# EAGLE design 12V PSU 700W (EAGLE 9.6.2)
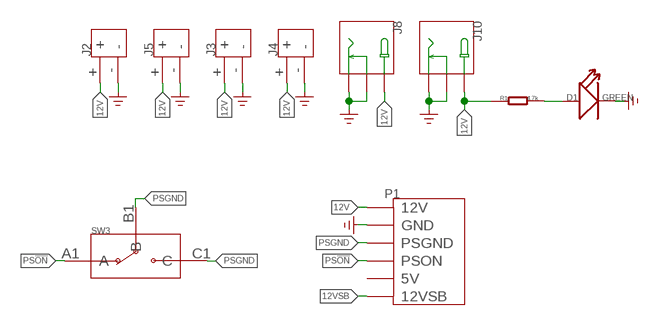
[diagram p0: schematic, sheet 1]

## Parts
D1  GREEN  LED0603  [LED-0603]
J2  XT-PWR-CONN-THXT60-F  [XT60-F-TH]
J3  XT-PWR-CONN-THXT30-F  [XT30-F-TH]
J4  XT-PWR-CONN-THXT30-F  [XT30-F-TH]
J5  XT-PWR-CONN-THXT60-F  [XT60-F-TH]
J8  POWER-JACK-DC'DC-012A'  [DCJ3P-14.2X11.0X9.0MM-V]
J10  POWER-JACK-DC'DC-012A'  [DCJ3P-14.2X11.0X9.0MM-V]
P1  PSU-750W  [PSU-750W]
R1  4.7k  R-0603  [R0603]
SW3  SWITCH-STICK-3P  [SWITCH-STICK-3P]

## Nets
12V: J2.+ J3.+ J4.+ J5.+ J8.+ J10.+ P1.P4(12V) P1.P5(12V) P1.P6(12V) R1.1
12VSB: P1.7(12VSB)
GND: D1.- J2.- J3.- J4.- J5.- J8.- J8.S(CDN) J10.- J10.S(CDN) P1.P1(GND) P1.P2(GND) P1.P3(GND) ; supply symbol labelled GND_POWER
N$4: D1.+ R1.2
PS!ON: P1.11(PSON) SW3.A1(A)
PSGND: P1.15(PSGND) SW3.B1(B) SW3.C1(C)
Unconnected: P1.5(5V) P1.9(5V) P1.13(5V)

## Library data of the parts
D1 = G2:LED
J2-J5 = DC PSU:XT-PWR-CONN-TH
J8 J10 = DC PSU:POWER-JACK-DC: 3P-L11.6*W9.6*H7.0MM:320120002;3P-L14.2*W11.0*H9.0MM:320120003
P1 = DC PSU:PSU-750W
R1 = GroveX:R*
SW3 = DC PSU:SWITCH-STICK-3P

## Net classes
0 default: width 0.127 mm, drill 0.203 mm, clearance 0.127 mm

## Board
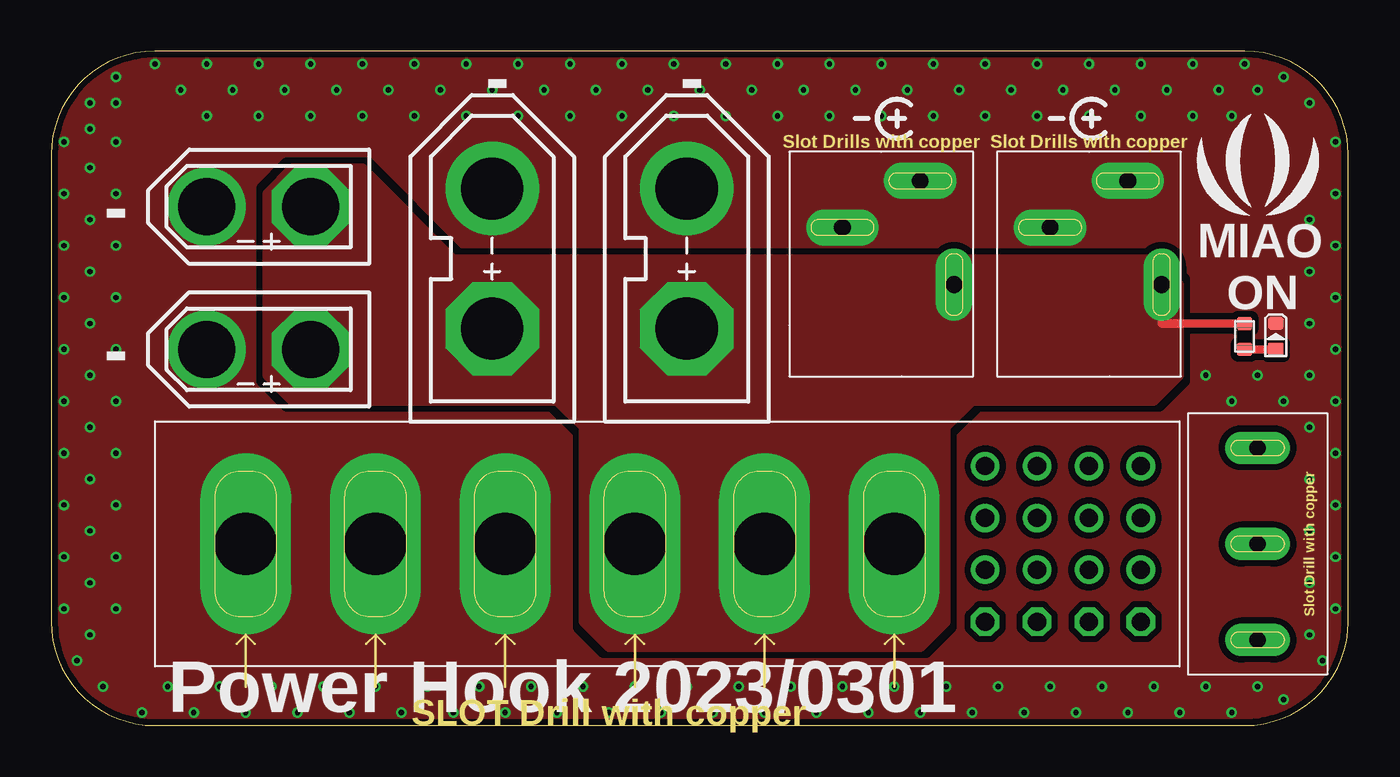
[diagram p1: board, top side]
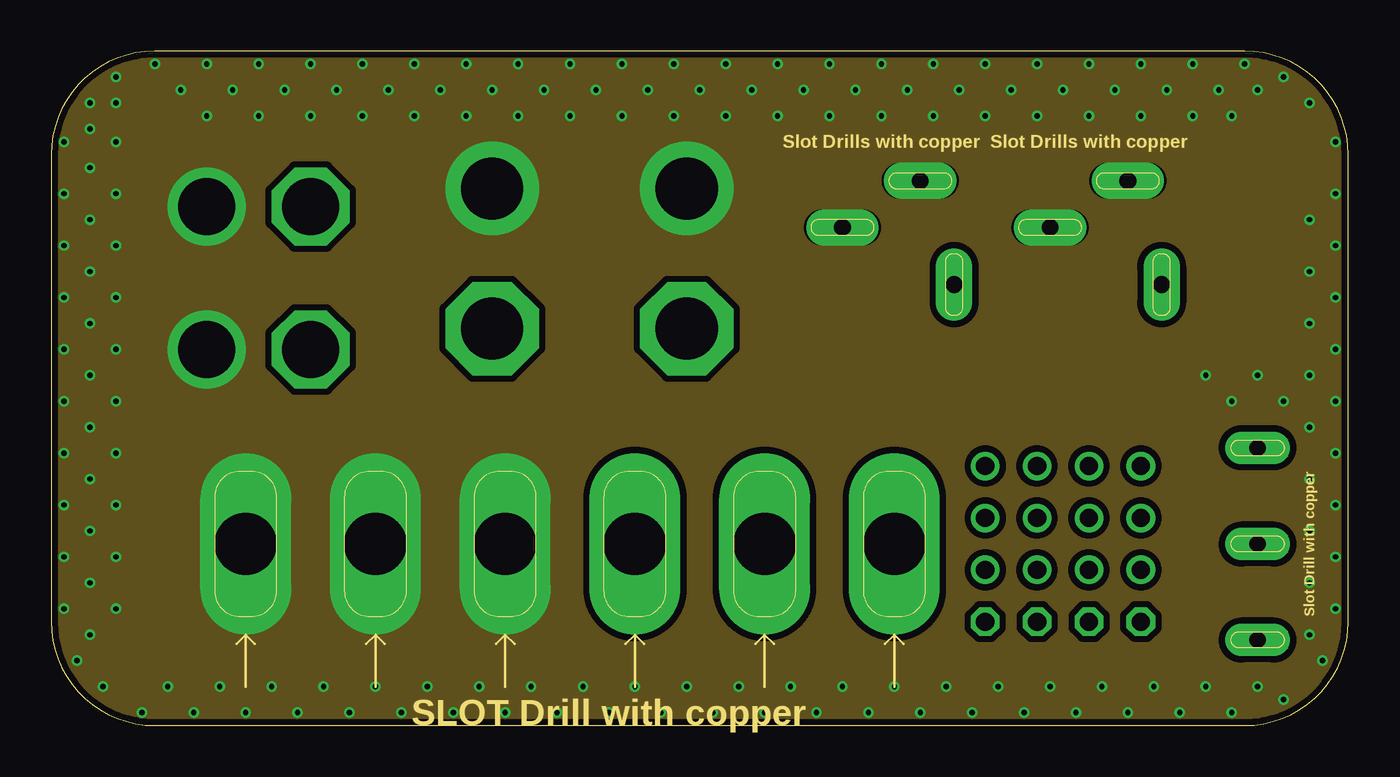
[diagram p2: board, inner layer Route2]
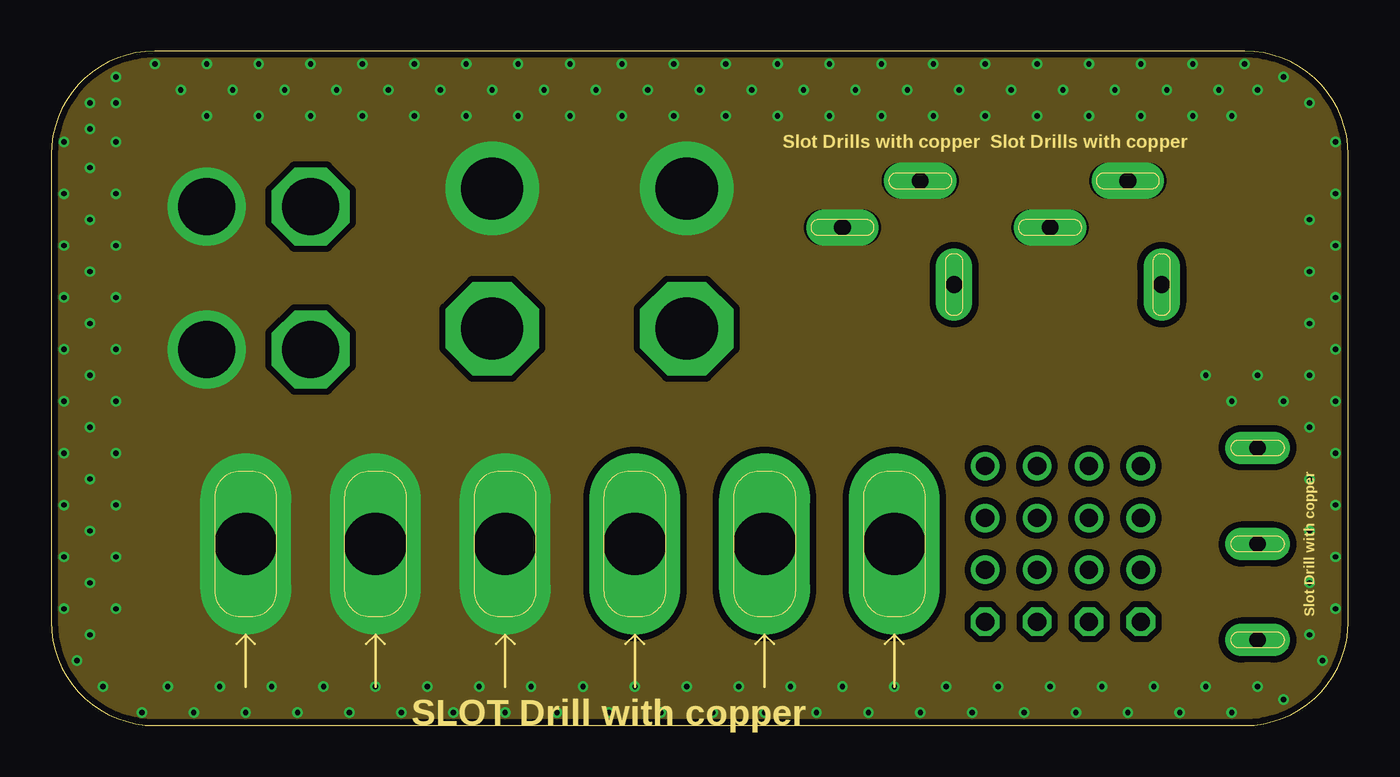
[diagram p3: board, inner layer Route15]
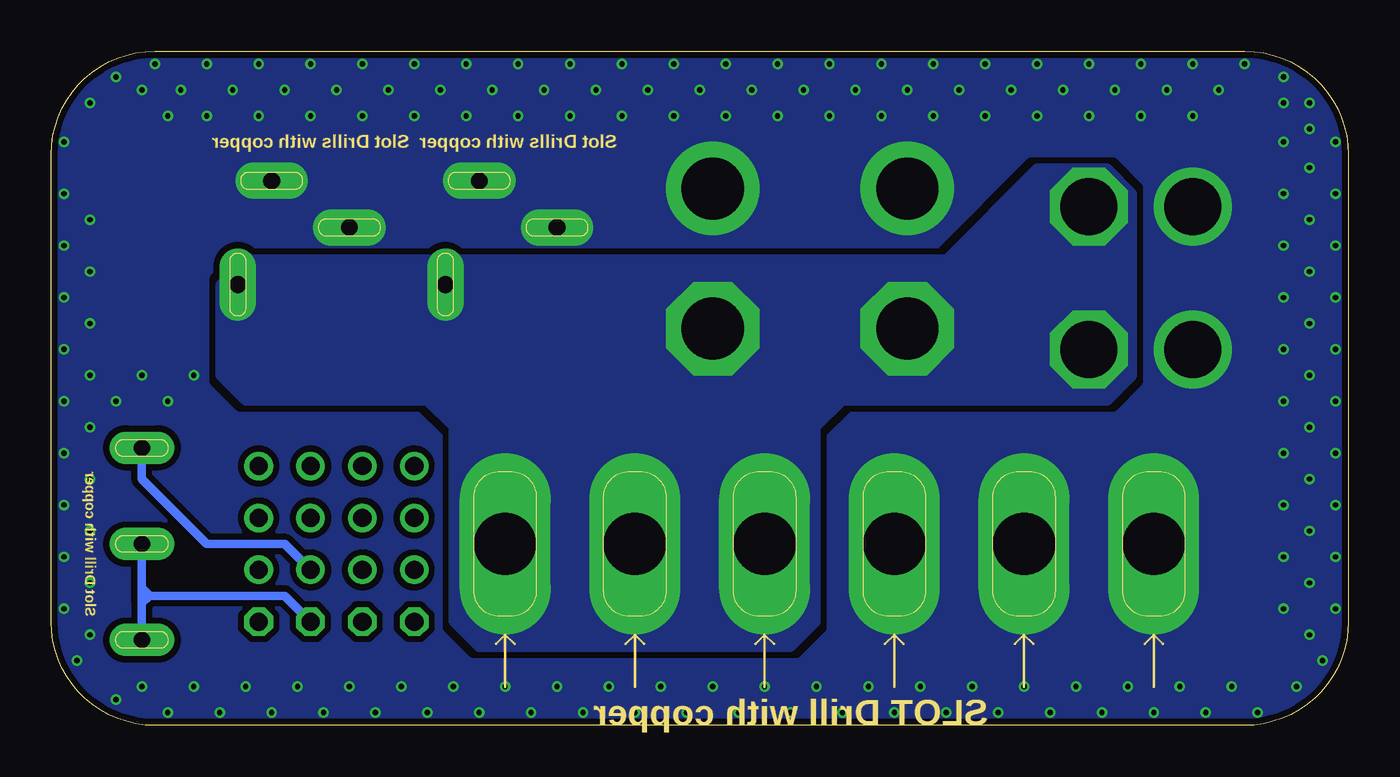
[diagram p4: board, bottom side, seen from below]

Size 63.5 x 33.02 mm. Coordinates in mm from the lower left corner, seen from the top.
Outline: 63.5,5.08 63.5,27.94 arc90 58.42,33.02 5.08,33.02 arc90 0,27.94 0,5.08 arc90 5.08,0 58.42,0 arc90 63.5,5.08
Copper layers (1+2*15+16): Top 0.035mm / dielectric 1.5mm / Route2 0.035mm / dielectric 0.15mm / Route15 0.035mm / dielectric 0.2mm / Bottom 0.035mm
Design rules "default *": minimum track width 1mil, minimum drill 8mil, track to track 6mil, track to pad 6mil, pad to pad 6mil, via to via 6mil, smd to smd 0mil, copper to edge 8mil, drill to drill 8mil, minimum pad ring 4mil, minimum via ring 4mil, stop-mask expansion 4mil, vias tented up to drill 20mil, thermal gap 10mil

### Footprints (pad centres in the part's own frame; a part is rotated, then mirrored left to right if it is on the bottom)
LED-0603 = smd 0.635 x 0.762: + -0.635,0; - 0.635,0
XT60-F-TH = drill 3.048 pad 4.572 octagon: + -3.429,0 | drill 3.048 pad 4.572: - 3.429,0
XT30-F-TH = drill 2.794 pad 3.81 octagon: + -2.54,0 | drill 2.794 pad 3.81: - 2.54,0
DCJ3P-14.2X11.0X9.0MM-V = drill 0.813 pad 1.778 long: + -3.556,0; - -1.905,-5.08; S 1.905,-2.794
PSU-750W = drill 0.889 pad 1.397: 1 10.795,3.81; 2 13.335,3.81; 3 15.875,3.81; 4 18.415,3.81; 5 10.795,1.27; 6 13.335,1.27; 7 15.875,1.27; 8 18.415,1.27; 9 10.795,-1.27; 10 13.335,-1.27; 11 15.875,-1.27; 12 18.415,-1.27 | drill 0.889 pad 1.397 octagon: 13 10.795,-3.81; 14 13.335,-3.81; 15 15.875,-3.81; 16 18.415,-3.81 | drill 3.048 pad 4.445 long: P1 -25.4,0; P2 -19.05,0; P3 -12.7,0; P4 -6.35,0; P5 0,0; P6 6.35,0
R0603 = smd 0.635 x 0.762: 1 -0.635,0; 2 0.635,0
SWITCH-STICK-3P = drill 0.8 pad 1.6 long: A1 -4.7,0; B1 0,0; C1 4.7,0

### Placement (x,y rotation side)
D1  59.94,19.05 90 top
J2  31.11,22.86 90 top
J3  10.16,18.41 180 top
J4  10.16,25.4 180 top
J5  21.59,22.86 90 top
J8  40.64,21.59 180 top
J10  50.8,21.59 180 top
P1  34.92,8.89 0 top
R1  58.42,19.05 270 top
SW3  59.05,8.89 270 top
U$11  [SEEED-SILK-280*268MIL]  59.05,26.67 0 top

### Tracks (layer width: path | path; a pad name or v marks a point on that pad's centre or on a via)
12V
  Top 0.406: R1.1 54.36,19.68 J10.+
  pour Top (isolate 0.406, no thermals): 26.04,5.08 26.04,14.61 24.77,15.88 11.81,15.88 10.54,17.14 10.54,26.04 11.81,27.3 15.24,27.3 19.68,22.86 53.98,22.86 55.24,21.59 55.24,17.14 53.98,15.88 45.09,15.88 43.81,14.61 43.81,5.08 42.55,3.81 27.3,3.81
  pour Bottom (isolate 0.406, no thermals): 26.04,5.08 26.04,14.61 24.77,15.88 11.81,15.88 10.54,17.14 10.54,26.04 11.81,27.3 15.24,27.3 19.68,22.86 53.98,22.86 55.24,21.59 55.24,17.14 53.98,15.88 45.09,15.88 43.81,14.61 43.81,5.08 42.55,3.81 27.3,3.81
GND  (via drill 0.25 pad 0.51)
  other vias: 1.91,30.48 3.17,31.75 5.08,32.38 0.64,28.57 0.64,26.04 0.64,23.5 0.64,20.95 0.64,18.41 0.64,15.88 0.64,13.34 0.64,10.79 0.64,8.26 0.64,5.71 1.91,6.99 1.91,4.45 1.27,3.17 2.54,1.91 4.45,0.64 6.99,0.64 9.53,0.64 12.06,0.64 14.61,0.64 17.14,0.64 19.68,0.64 22.23,0.64 24.77,0.64 27.3,0.64 29.84,0.64 32.38,0.64 34.92,0.64 37.47,0.64 40.01,0.64 42.55,0.64 45.09,0.64 47.62,0.64 50.16,0.64 52.7,0.64 55.24,0.64 57.78,0.64 60.33,1.27 62.23,3.17 62.87,5.71 62.87,8.26 62.87,10.79 62.87,13.34 62.87,15.88 62.87,18.41 62.87,20.95 62.87,23.5 62.87,26.04 62.87,28.57 61.59,30.48 60.33,31.75 58.42,32.38 55.88,32.38 53.34,32.38 50.8,32.38 48.26,32.38 45.72,32.38 43.18,32.38 40.64,32.38 38.1,32.38 35.56,32.38 33.02,32.38 30.48,32.38 27.94,32.38 25.4,32.38 22.86,32.38 20.32,32.38 17.78,32.38 15.24,32.38 12.7,32.38 10.16,32.38 7.62,32.38 6.35,31.11 59.05,31.11 57.15,31.11 54.61,31.11 52.07,31.11 49.53,31.11 46.99,31.11 44.45,31.11 41.91,31.11 39.37,31.11 36.83,31.11 34.29,31.11 31.75,31.11 29.21,31.11 26.67,31.11 24.13,31.11 21.59,31.11 19.05,31.11 16.51,31.11 13.97,31.11 11.43,31.11 8.89,31.11 57.78,29.84 55.88,29.84 53.34,29.84 50.8,29.84 48.26,29.84 45.72,29.84 43.18,29.84 40.64,29.84 38.1,29.84 35.56,29.84 33.02,29.84 30.48,29.84 27.94,29.84 25.4,29.84 22.86,29.84 20.32,29.84 17.78,29.84 15.24,29.84 12.7,29.84 10.16,29.84 7.62,29.84 61.59,19.68 61.59,22.23 61.59,24.77 61.59,17.14 59.05,17.14 56.52,17.14 57.78,15.88 60.33,15.88 61.59,14.61 61.59,12.06 61.59,9.53 61.59,6.99 61.59,4.45 56.52,1.91 59.05,1.91 3.17,5.71 3.17,8.26 3.17,10.79 3.17,13.34 3.17,15.88 3.17,18.41 3.17,20.95 3.17,23.5 3.17,26.04 3.17,28.57 3.17,30.48 1.91,9.53 1.91,12.06 1.91,14.61 1.91,17.14 1.91,19.68 1.91,22.23 1.91,24.77 1.91,27.3 1.91,29.21 5.71,1.91 8.26,1.91 10.79,1.91 13.34,1.91 15.88,1.91 18.41,1.91 20.95,1.91 23.5,1.91 26.04,1.91 28.57,1.91 31.11,1.91 33.66,1.91 36.2,1.91 38.73,1.91 41.27,1.91 43.81,1.91 46.35,1.91 48.9,1.91 51.44,1.91 53.98,1.91
  pour Top (isolate 0.305, rank 6, no thermals): 0,33.02 63.5,33.02 63.5,0 0,0
  pour Bottom (isolate 0.305, rank 6, no thermals): 0,33.02 63.5,33.02 63.5,0 0,0
  pour Route15 (isolate 0.305, rank 6, no thermals): 0,33.02 63.5,33.02 63.5,0 0,0
  pour Route2 (isolate 0.305, rank 6, no thermals): 0,33.02 63.5,33.02 63.5,0 0,0
N$4
  Top 0.406: R1.2 D1.+
PS!ON
  Bottom 0.406: P1.11 52.07,8.89 55.88,8.89 59.05,12.06 SW3.A1
PSGND
  Bottom 0.406: P1.15 52.07,6.35 58.67,6.35 | 59.05,6.73 58.67,6.35 | 59.05,6.73 SW3.B1 | 58.67,6.35 59.05,5.97 | 59.05,5.97 SW3.C1 | 59.05,5.97 59.05,6.73

### Text on the board
tNames: - | - | - | MIAO | ON | - | Power Hook 2023/0301